# EAGLE design 4P_sarantel_test (EAGLE 4.16)
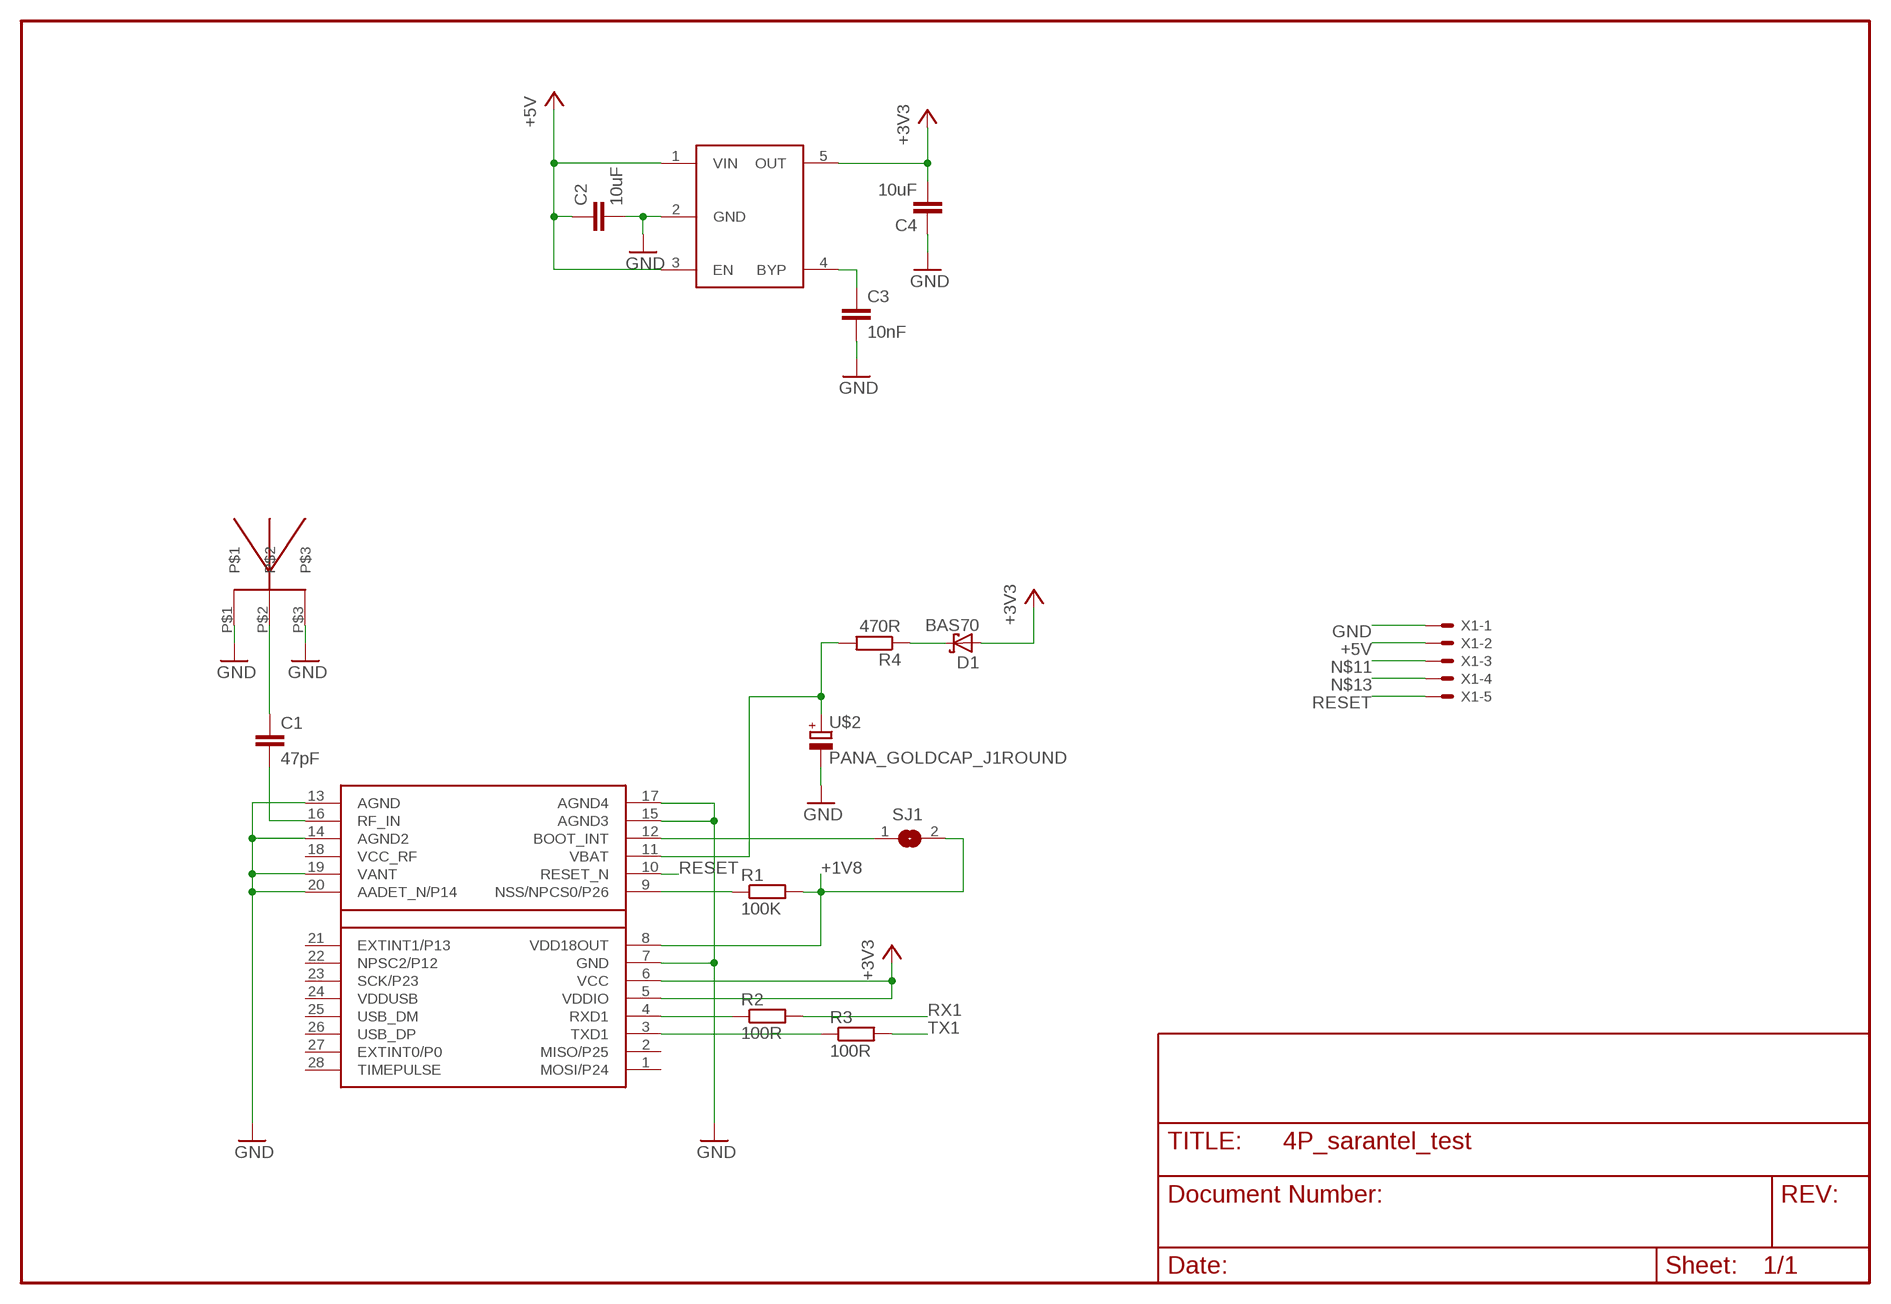
[diagram p0: schematic, sheet 1]

## Parts
C1  47pF  C-EUC0402K  [C0402K]
C2  10uF  C-EUC1210K  [C1210K]
C3  10nF  C-EUC0402K  [C0402K]
C4  10uF  C-EUC1210K  [C1210K]
D1  BAS70  [SOT23]
R1  100K  R-EU_R0402  [R0402]
R2  100R  R-EU_R0402  [R0402]
R3  100R  R-EU_R0402  [R0402]
R4  470R  R-EU_R0402  [R0402]
SJ1  SJ  [SJ]
U$1  LEA-4P  [LEA-LA]
U$2  PANA_GOLDCAP_J1ROUND  [PANA_J1_BIS]
U$3  MIC5255  [SOT23-5L]
U$4  GEOHELIXP2S  [GEO_P2_S]
X1  53047-05  [53047-05]

## Nets
+1V8: R1.2 SJ1.2 U$1.8(VDD18OUT)
+3V3: C4.2 D1.1(A) U$1.5(VDDIO) U$1.6(VCC) U$3.5(OUT)
+5V: C2.1 U$3.1(VIN) U$3.3(EN) X1.2
GND: C2.2 C3.2 C4.1 U$1.7(GND) U$1.13(AGND) U$1.14(AGND2) U$1.15(AGND3) U$1.17(AGND4) U$1.19(VANT) U$1.20(AADET_N/P14) U$2.MINUS(-) U$3.2(GND) U$4.P$1 U$4.P$3 X1.1
N$1: R4.2 U$1.11(VBAT) U$2.PLUS(+)
N$2: R1.1 U$1.9(NSS/NPCS0/P26)
N$3: R2.1 U$1.4(RXD1)
N$4: R3.1 U$1.3(TXD1)
N$5: SJ1.1 U$1.12(BOOT_INT)
N$6: C1.2 U$1.16(RF_IN)
N$7: C1.1 U$4.P$2
N$9: C3.1 U$3.4(BYP)
N$11: X1.3
N$12: D1.3(C) R4.1
N$13: X1.4
RESET: U$1.10(RESET_N) X1.5
RX1: R2.2
TX1: R3.2
Unconnected: U$1.1(MOSI/P24) U$1.2(MISO/P25) U$1.21(EXTINT1/P13) U$1.22(NPSC2/P12) U$1.23(SCK/P23) U$1.24(VDDUSB) U$1.25(USB_DM) U$1.26(USB_DP) U$1.27(EXTINT0/P0) U$1.28(TIMEPULSE)

## Power pins joined to a net without a drawn wire
VCC_RF: U$1.18(VCC_RF)

## Library data of the parts
C1-C4 = rcl:C-EU: CAPACITOR, European symbol
D1 = diode:BAS70: Silicon Schottky Diodes General-purpose diode for high-speed switching
R1-R4 = rcl:R-EU_: RESISTOR, European symbol
SJ1 = jumper:SJ: SMD solder JUMPER
U$1 = paparazzi:LEA-4P
U$2 = paparazzi:PANA_GOLDCAP_J1
U$3 = paparazzi:MIC5255
U$4 = paparazzi:GEOHELIX
X1 = con-molex:53?-05: CONNECTOR wire to board 1.25 mm (.049 inch) pitch header

## Board
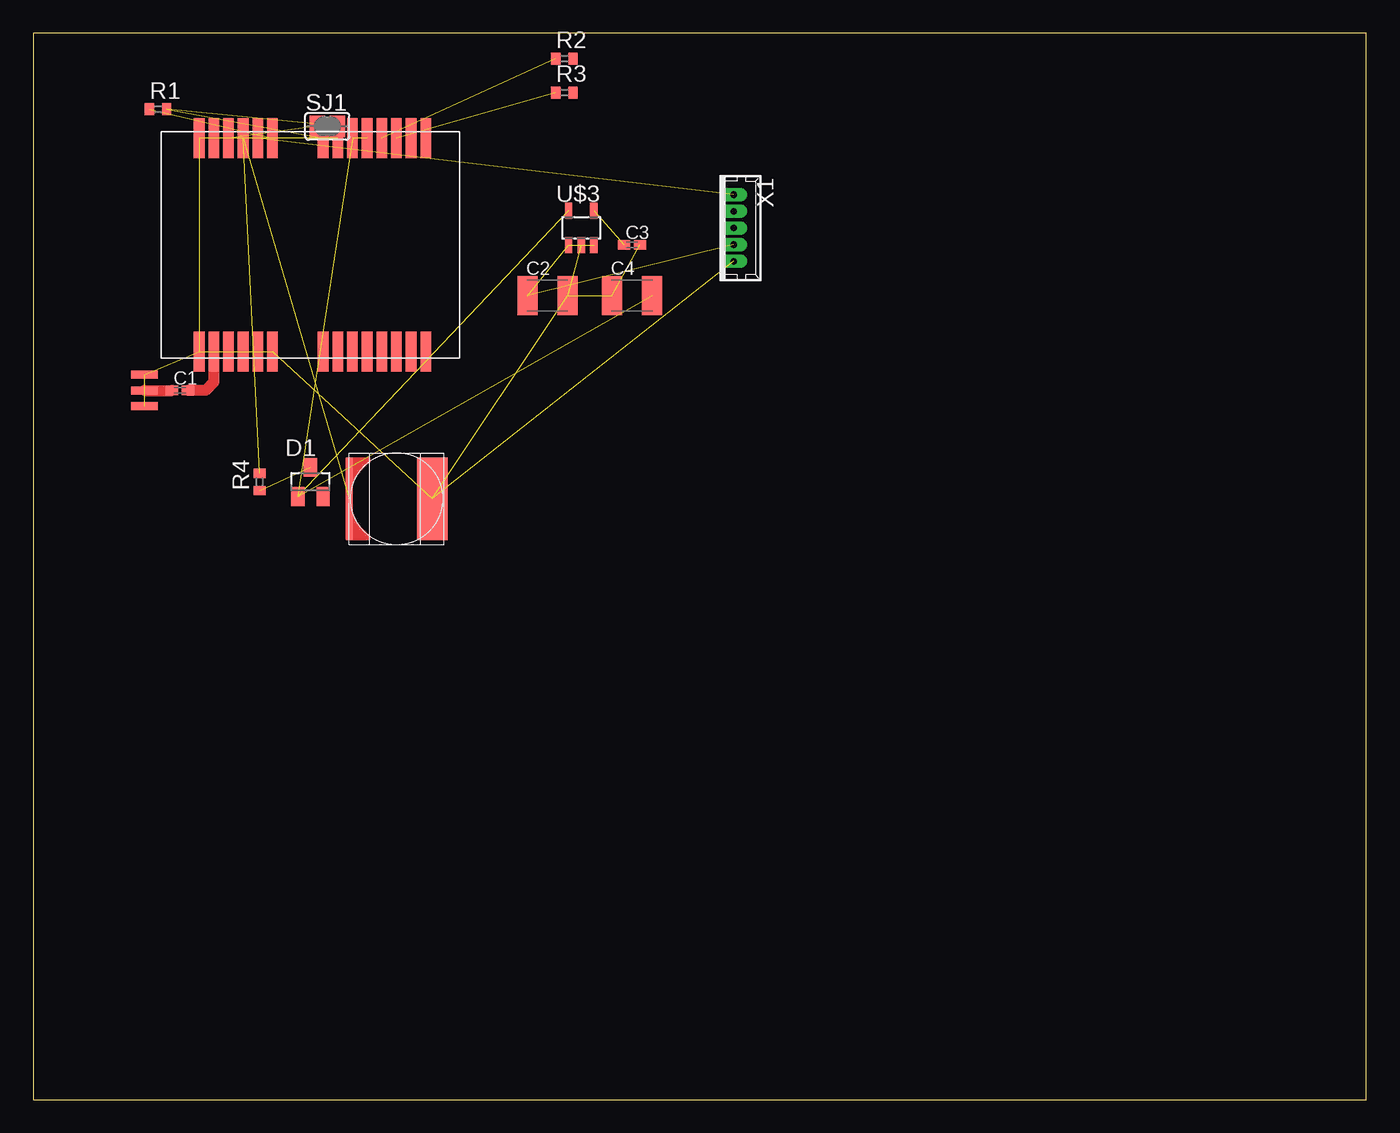
[diagram p1: board, top side]

Size 100 x 80 mm. Coordinates in mm from the lower left corner, seen from the top.
Outline: 0,0 100,0 100,80 0,80 0,0
Copper layers (1*16): Top 0.035mm / dielectric 1.5mm / Bottom 0.035mm
Design rules "default": minimum track width 10mil, minimum drill 24mil, track to track 8mil, track to pad 8mil, pad to pad 8mil, via to via 8mil, smd to smd 8mil, copper to edge 40mil, drill to drill 8mil, minimum pad ring 10mil, minimum via ring 8mil, stop-mask expansion 4mil, vias tented up to drill 0mil, thermal gap 10mil

### Footprints (pad centres in the part's own frame; a part is rotated, then mirrored left to right if it is on the bottom)
C0402K = smd 0.925 x 0.74: 1 -0.6,0; 2 0.6,0
C1210K = smd 1.5 x 2.9: 1 -1.5,0; 2 1.5,0
SOT23 = smd 1 x 1.4: 1 -0.95,-1.1; 2 0.95,-1.1; 3 0,1.1
R0402 = smd 0.7 x 0.9: 1 -0.65,0; 2 0.65,0
SJ = smd 1.168 x 1.6: 1 -0.762,0; 2 0.762,0
LEA-LA = smd 3 x 0.8: 1 8,-8.65; 2 8,-7.55; 3 8,-6.45; 4 8,-5.35; 5 8,-4.25; 6 8,-3.15; 7 8,-2.05; 8 8,-0.95; 9 8,2.85; 10 8,3.95; 11 8,5.05; 12 8,6.15; 13 8,7.25; 14 8,8.35; 15 -8,8.35; 16 -8,7.25; 17 -8,6.15; 18 -8,5.05; 19 -8,3.95; 20 -8,2.85; 21 -8,-0.95; 22 -8,-2.05; 23 -8,-3.15; 24 -8,-4.25; 25 -8,-5.35; 26 -8,-6.45; 27 -8,-7.55; 28 -8,-8.65
PANA_J1_BIS = smd 6.2 x 2.3: MINUS 0,-2.794 | smd 6.198 x 0.508: PLUS 0,3.429
SOT23-5L = smd 0.55 x 1.2: 1 -0.95,-1.3; 2 0,-1.3; 3 0.95,-1.3; 4 0.95,1.3; 5 -0.95,1.3
GEO_P2_S = smd 0.6 x 2: P$1 -1.17,0; P$2 0,0; P$3 1.17,0
53047-05 = drill 0.5 pad 0.698 long: 1 2.5,0; 2 1.25,0; 3 0,0; 4 -1.25,0; 5 -2.5,0

### Placement (x,y rotation side)
C1  11.01,53.21 0 top
C2  38.57,60.32 0 top
C3  44.92,64.13 0 top
C4  44.92,60.32 0 top
D1  20.79,46.35 0 top
R1  9.36,74.29 0 top
R2  39.84,78.1 0 top
R3  39.84,75.56 0 top
R4  16.98,46.35 90 top
SJ1  22.06,73.02 0 top
U$1  20.79,64.13 90 top
U$2  27.14,45.08 90 top
U$3  41.11,65.4 0 top
U$4  8.34,53.21 90 top
X1  52.54,65.4 270 top

### Tracks (layer width: path | path; a pad name or v marks a point on that pad's centre or on a via)
+1V8  (2 unrouted)
+3V3  (4 unrouted)
+5V  (3 unrouted)
GND  (14 unrouted)
N$1  (2 unrouted)
N$2  (1 unrouted)
N$3  (1 unrouted)
N$4  (1 unrouted)
N$5  (1 unrouted)
N$6
  Top 0.813: U$1.16 13.54,53.83 12.92,53.21 C1.2
N$7
  Top 0.813: U$4.P$2 C1.1
N$9  (1 unrouted)
N$12  (1 unrouted)
RESET  (1 unrouted)